# Altium project esp-air-quality-sensor.PrjPcb
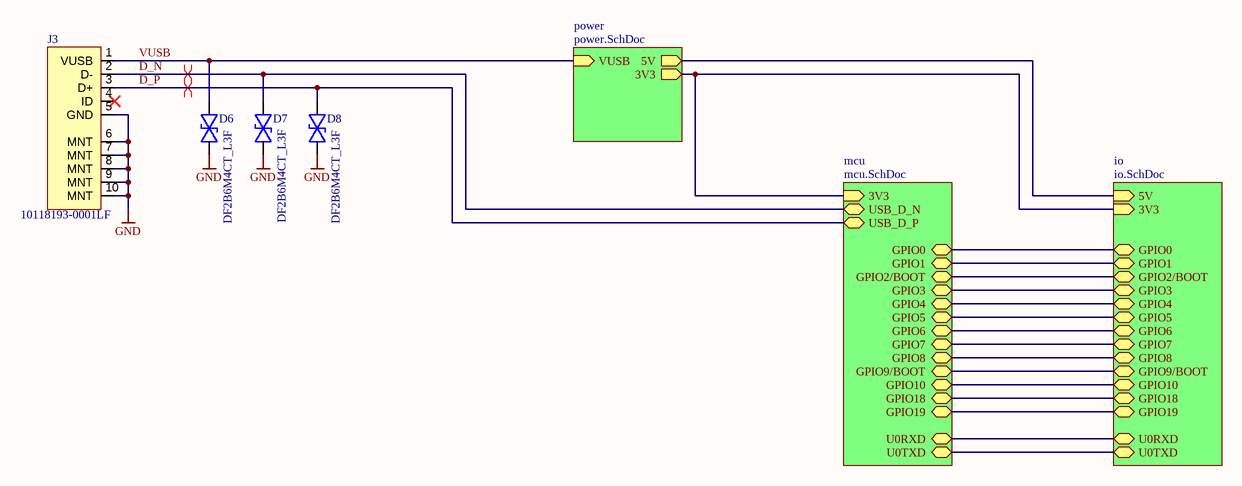
[diagram p0: top.SchDoc]
4 sheets, 65 parts. Net scope: strictly hierarchical (ports join the sheet entries above them; power ports are local).
Board file: board.PcbDoc
Sheets:
  top.SchDoc
    power = power.SchDoc
    mcu = mcu.SchDoc
    io = io.SchDoc

## Sheet top.SchDoc: top schematic
size 420 x 297 mm; Date: 2021-12-08; Author: Joachim Löfwander; Revision: AAA-000; SheetNumber: 1; SheetTotal: 4; Website: github.com/jlofw

### Parts
D6  Manufacturer P/N: DF2B6M4CT_L3F  [D_SOD-882]  (hidden comment: diode_TVS_bi)
D7  Manufacturer P/N: DF2B6M4CT_L3F  [D_SOD-882]  (hidden comment: diode_TVS_bi)
D8  Manufacturer P/N: DF2B6M4CT_L3F  [D_SOD-882]  (hidden comment: diode_TVS_bi)
J3  Manufacturer P/N: 10118193-0001LF  [Amphenol_10118193-0001LF_Micro_USB]  (hidden comment: Amphenol_10118193-0001LF_Micro_USB)

### Sub-sheets
io = io.SchDoc: 5V (in), 3V3 (in), GPIO0 (bidir), GPIO1 (bidir), GPIO3 (bidir), GPIO4 (bidir), GPIO5 (bidir), GPIO6 (bidir), GPIO7 (bidir), GPIO10 (bidir), GPIO18 (bidir), GPIO19 (bidir), GPIO2/BOOT (bidir), GPIO8 (bidir), GPIO9/BOOT (bidir), U0RXD (bidir), U0TXD (bidir)
mcu = mcu.SchDoc: 3V3 (in), USB_D_P (bidir), USB_D_N (bidir), GPIO19 (bidir), GPIO0 (bidir), GPIO4 (bidir), GPIO3 (bidir), GPIO7 (bidir), GPIO18 (bidir), GPIO1 (bidir), GPIO5 (bidir), GPIO6 (bidir), GPIO10 (bidir), GPIO9/BOOT (bidir), GPIO2/BOOT (bidir), GPIO8 (bidir), U0TXD (bidir), U0RXD (bidir)
power = power.SchDoc: VUSB (in), 3V3 (out), 5V (out)

### Nets
GND: D6.2(A) D7.2(A) D8.2(A) J3.5(GND) J3.6(MNT) J3.7(MNT) J3.8(MNT) J3.9(MNT) J3.10(MNT)
3V3: sheet power/3V3, sheet mcu/3V3, sheet io/3V3
5V: sheet power/5V, sheet io/5V
D_N: D7.1(C) J3.2(D-) ; sheet mcu/USB_D_N
D_P: D8.1(C) J3.3(D+) ; sheet mcu/USB_D_P
GPIO0: sheet mcu/GPIO0, sheet io/GPIO0
GPIO1: sheet mcu/GPIO1, sheet io/GPIO1
GPIO2/BOOT: sheet mcu/GPIO2/BOOT, sheet io/GPIO2/BOOT
GPIO3: sheet mcu/GPIO3, sheet io/GPIO3
GPIO4: sheet mcu/GPIO4, sheet io/GPIO4
GPIO5: sheet mcu/GPIO5, sheet io/GPIO5
GPIO6: sheet mcu/GPIO6, sheet io/GPIO6
GPIO7: sheet mcu/GPIO7, sheet io/GPIO7
GPIO8: sheet mcu/GPIO8, sheet io/GPIO8
GPIO9/BOOT: sheet mcu/GPIO9/BOOT, sheet io/GPIO9/BOOT
GPIO10: sheet mcu/GPIO10, sheet io/GPIO10
GPIO18: sheet mcu/GPIO18, sheet io/GPIO18
GPIO19: sheet mcu/GPIO19, sheet io/GPIO19
U0RXD: sheet mcu/U0RXD, sheet io/U0RXD
U0TXD: sheet mcu/U0TXD, sheet io/U0TXD
VUSB: D6.1(C) J3.1(VUSB) ; sheet power/VUSB

Not connected (* = marked no-connect by the designer): J3 4(ID)*

### Layout directives
differential pair: D_N, D_P

### Notes on the sheet
- PROJECT
- TITLE
- FILE NAME
- DATE MODIFIED
- SHEET
- REV
- OF
- AUTHOR
- WEBSITE

### Library data of the parts
D6-D8 = 40005: TVS DIODE 5.5VWM 15VC; Manufacturer: Toshiba; Internal Number: 40005; Package: SOD-882
J3 = 110003: Micro USB B SMD Horisontal; Manufacturer: Amphenol ICC / FCI; Internal Number: 110003

## Sheet power.SchDoc: power
size 420 x 297 mm; Date: 2021-12-08; Author: Joachim Löfwander; Revision: AAA-000; SheetNumber: 2; SheetTotal: 4; Website: github.com/jlofw
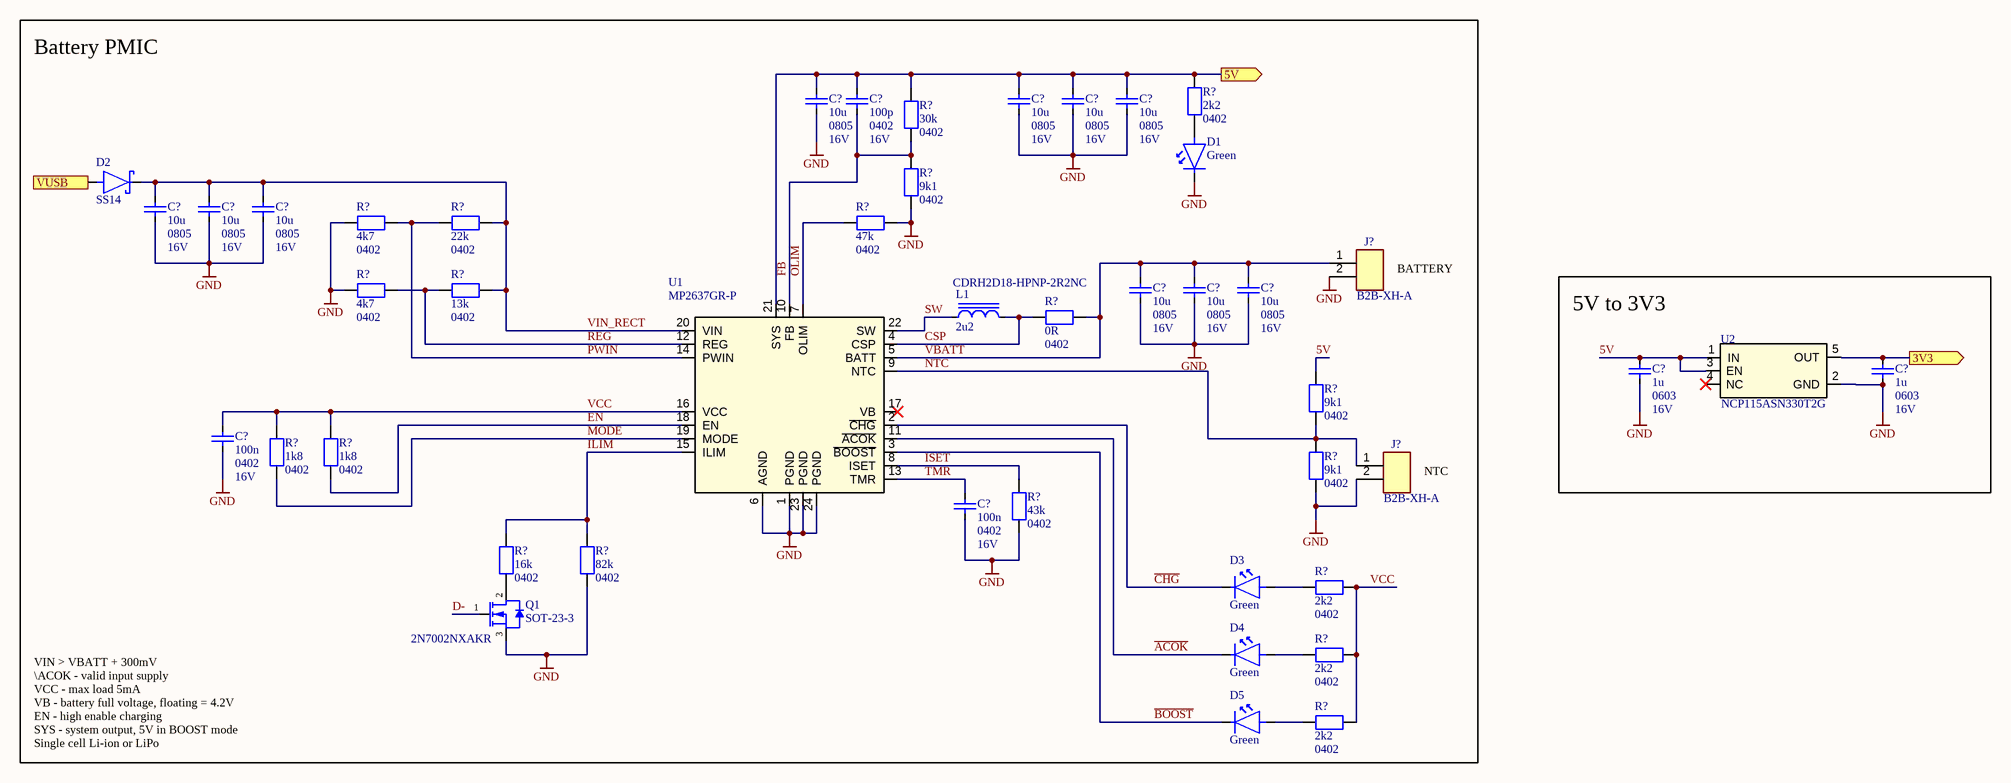
[diagram p1: power.SchDoc]

### Parts
(Parts that share a designator on the sheet are numbered #1, #2 ... from top to bottom, then left to right.)
C?#1  value 10u  Package: 0805  Voltage: 16V  [C_0805_2012Metric_IPCB]  (hidden comment: capacitor_ceramic)
C?#2  value 100p  Package: 0402  Voltage: 16V  [C_0402_1005Metric_IPCB]  (hidden comment: capacitor_ceramic)
C?#3  value 10u  Package: 0805  Voltage: 16V  [C_0805_2012Metric_IPCB]  (hidden comment: capacitor_ceramic)
C?#4  value 10u  Package: 0805  Voltage: 16V  [C_0805_2012Metric_IPCB]  (hidden comment: capacitor_ceramic)
C?#5  value 10u  Package: 0805  Voltage: 16V  [C_0805_2012Metric_IPCB]  (hidden comment: capacitor_ceramic)
C?#6  value 10u  Package: 0805  Voltage: 16V  [C_0805_2012Metric_IPCB]  (hidden comment: capacitor_ceramic)
C?#7  value 10u  Package: 0805  Voltage: 16V  [C_0805_2012Metric_IPCB]  (hidden comment: capacitor_ceramic)
C?#8  value 10u  Package: 0805  Voltage: 16V  [C_0805_2012Metric_IPCB]  (hidden comment: capacitor_ceramic)
C?#9  value 10u  Package: 0805  Voltage: 16V  [C_0805_2012Metric_IPCB]  (hidden comment: capacitor_ceramic)
C?#10  value 10u  Package: 0805  Voltage: 16V  [C_0805_2012Metric_IPCB]  (hidden comment: capacitor_ceramic)
C?#11  value 10u  Package: 0805  Voltage: 16V  [C_0805_2012Metric_IPCB]  (hidden comment: capacitor_ceramic)
C?#12  value 1u  Package: 0603  Voltage: 16V  [C_0603_1608Metric_IPCB]  (hidden comment: capacitor_ceramic)
C?#13  value 1u  Package: 0603  Voltage: 16V  [C_0603_1608Metric_IPCB]  (hidden comment: capacitor_ceramic)
C?#14  value 100n  Package: 0402  Voltage: 16V  [C_0402_1005Metric_IPCB]  (hidden comment: capacitor_ceramic)
C?#15  value 100n  Package: 0402  Voltage: 16V  [C_0402_1005Metric_IPCB]  (hidden comment: capacitor_ceramic)
D1  value Green  [LED_0402]  (hidden comment: diode_LED)
D2  Manufacturer P/N: SS14  [D_SMA_IPCB]  (hidden comment: diode_schottky)
D3  value Green  [LED_0402]  (hidden comment: diode_LED)
D4  value Green  [LED_0402]  (hidden comment: diode_LED)
D5  value Green  [LED_0402]  (hidden comment: diode_LED)
J?#1  Manufacturer P/N: B2B-XH-A  [JST_XH_B2B-XH-A]  (hidden comment: conn_01x02)
J?#2  Manufacturer P/N: B2B-XH-A  [JST_XH_B2B-XH-A]  (hidden comment: conn_01x02)
L1  value 2u2  Manufacturer P/N: CDRH2D18-HPNP-2R2NC  [Sumida_CDRH2D18-HPNP-2R2NC]  (hidden comment: inductor)
Q1  Package: SOT-23-3  Manufacturer P/N: 2N7002NXAKR  [SOT23-3_Standard_IPCB]  (hidden comment: NMOS_GDS)
R?#1  value 2k2  Package: 0402  [R_0402_1005Metric_IPCB]  (hidden comment: resistor)
R?#2  value 30k  Package: 0402  [R_0402_1005Metric_IPCB]  (hidden comment: resistor)
R?#3  value 9k1  Package: 0402  [R_0402_1005Metric_IPCB]  (hidden comment: resistor)
R?#4  value 4k7  Package: 0402  [R_0402_1005Metric_IPCB]  (hidden comment: resistor)
R?#5  value 22k  Package: 0402  [R_0402_1005Metric_IPCB]  (hidden comment: resistor)
R?#6  value 47k  Package: 0402  [R_0402_1005Metric_IPCB]  (hidden comment: resistor)
R?#7  value 4k7  Package: 0402  [R_0402_1005Metric_IPCB]  (hidden comment: resistor)
R?#8  value 13k  Package: 0402  [R_0402_1005Metric_IPCB]  (hidden comment: resistor)
R?#9  value 0R  Package: 0402  [R_0402_1005Metric_IPCB]  (hidden comment: resistor)
R?#10  value 9k1  Package: 0402  [R_0402_1005Metric_IPCB]  (hidden comment: resistor)
R?#11  value 1k8  Package: 0402  [R_0402_1005Metric_IPCB]  (hidden comment: resistor)
R?#12  value 1k8  Package: 0402  [R_0402_1005Metric_IPCB]  (hidden comment: resistor)
R?#13  value 9k1  Package: 0402  [R_0402_1005Metric_IPCB]  (hidden comment: resistor)
R?#14  value 43k  Package: 0402  [R_0402_1005Metric_IPCB]  (hidden comment: resistor)
R?#15  value 16k  Package: 0402  [R_0402_1005Metric_IPCB]  (hidden comment: resistor)
R?#16  value 82k  Package: 0402  [R_0402_1005Metric_IPCB]  (hidden comment: resistor)
R?#17  value 2k2  Package: 0402  [R_0402_1005Metric_IPCB]  (hidden comment: resistor)
R?#18  value 2k2  Package: 0402  [R_0402_1005Metric_IPCB]  (hidden comment: resistor)
R?#19  value 2k2  Package: 0402  [R_0402_1005Metric_IPCB]  (hidden comment: resistor)
U1  Manufacturer P/N: MP2637GR-P  [MP2637GR]  (hidden comment: MP2637GR)
U2  NCP115ASN330T2G  [NCP115ASN330T2G]

### Blocks framed on the sheet
Battery PMIC: C?#1-C?#11 C?#14 C?#15 D1-D5 J?#1 J?#2 L1 Q1 R?#1-R?#19 U1
5V to 3V3: C?#12 C?#13 U2

### Ports
3V3 (out), 5V (out), VUSB (in)

### Nets
GND: C?#1.1 C?#3.1 C?#4.1 C?#5.1 C?#6.1 C?#7.1 C?#8.1 C?#9.1 C?#10.1 C?#11.1 C?#12.1 C?#13.1 C?#14.1 C?#15.1 D1.1(C) J?#1.2 J?#2.2 Q1.3(SOURCE) R?#3.1 R?#4.1 R?#6.2 R?#7.1 R?#13.1 R?#14.1 R?#16.1 U1.1(PGND) U1.6(AGND) U1.23(PGND) U1.24(PGND) U2.2(GND)
3V3: C?#13.2 U2.5(OUT) ; port 3V3
5V: C?#1.2 C?#2.2 C?#3.2 C?#4.2 C?#5.2 R?#1.2 R?#2.2 U1.21(SYS) ; port 5V
5V: C?#12.2 R?#10.2 U2.1(IN) U2.3(EN)  [a separate net that carries the same name]
~{ACOK}: D4.1(C) U1.11(~{ACOK})
~{BOOST}: D5.1(C) U1.3(~{BOOST})
~{CHG}: D3.1(C) U1.2(~{CHG})
CSP: L1.2 R?#9.1 U1.4(CSP)
D-: Q1.1(GATE)
EN: R?#12.1 U1.18(EN)
FB: C?#2.1 R?#2.1 R?#3.2 U1.10(FB)
ILIM: R?#15.2 R?#16.2 U1.15(ILIM)
ISET: R?#14.2 U1.8(ISET)
MODE: R?#11.1 U1.19(MODE)
NTC: J?#2.1 R?#10.1 R?#13.2 U1.9(NTC)
OLIM: R?#6.1 U1.7(OLIM)
PWIN: R?#4.2 R?#5.1 U1.14(PWIN)
REG: R?#7.2 R?#8.1 U1.12(REG)
SW: L1.1 U1.22(SW)
TMR: C?#15.2 U1.13(TMR)
VBATT: C?#9.2 C?#10.2 C?#11.2 J?#1.1 R?#9.2 U1.5(BATT)
VCC: C?#14.2 R?#11.2 R?#12.2 R?#17.2 R?#18.2 R?#19.2 U1.16(VCC)
VIN_RECT: C?#6.2 C?#7.2 C?#8.2 D2.1(C) R?#5.2 R?#8.2 U1.20(VIN)
VUSB: D2.2(A) ; port VUSB
NetD1_2: D1.2(A) R?#1.1
NetD3_2: D3.2(A) R?#17.1
NetD4_2: D4.2(A) R?#18.1
NetD5_2: D5.2(A) R?#19.1
NetQ1_2: Q1.2(DRAIN) R?#15.1

Not connected (* = marked no-connect by the designer): U1 17(VB)*; U2 4(NC)*

### Notes on the sheet
- (near J?#1) BATTERY
- (near J?#2) NTC
- VIN > VBATT + 300mV
  \ACOK - valid input supply
  VCC - max load 5mA
  VB - battery full voltage, floating = 4.2V
  EN - high enable charging
  SYS - system output, 5V in BOOST mode
  Single cell Li-ion or LiPo
- PROJECT
- TITLE
- FILE NAME
- DATE MODIFIED
- SHEET
- REV
- OF
- AUTHOR
- WEBSITE

### Library data of the parts
C?#1 C?#3-C?#11 = 20174: 16V 0805; Internal Number: 20174
C?#2 = 20007: 16V 0402; Internal Number: 20007
C?#12 C?#13 = 20100: 16V 0603; Internal Number: 20100
C?#14 C?#15 = 20025: 16V 0402; Internal Number: 20025
D1 D3-D5 = 40002: LED 0402 Green; Internal Number: 40002; Package: 0402
D2 = 40006: Schottky 40 V 1A SMA; Manufacturer: onsemi; Internal Number: 40006; Package: SMA
J?#1 J?#2 = 110010: JST XH Vertical TH 2p; Internal Number: 110010; Manufacturer: JST
L1 = 190001: Inductor 2.2uH 1.6A 60mOhm; Manufacturer: Sumida; Internal Number: 190001
Q1 = 60001: 60V 300mA NMOS SOT-23-3; Manufacturer: Nexperia; Internal Number: 60001
R?#1 R?#17-R?#19 = 10082: 0402 1%; Internal Number: 10082
R?#2 = 10109: 0402 1%; Internal Number: 10109
R?#3 R?#10 R?#13 = 10097: 0402 1%; Internal Number: 10097
R?#4 R?#7 = 10090: 0402 1%; Internal Number: 10090
R?#5 = 10106: 0402 1%; Internal Number: 10106
R?#6 = 10114: 0402 1%; Internal Number: 10114
R?#8 = 10101: 0402 1%; Internal Number: 10101
R?#9 = 10001: 0402 1%; Internal Number: 10001
R?#11 R?#12 = 10080: 0402 1%; Internal Number: 10080
R?#14 = 10113: 0402 1%; Internal Number: 10113
R?#15 = 10103: 0402 1%; Internal Number: 10103
R?#16 = 10120: 0402 1%; Internal Number: 10120
U1 = 180003: MP2637GR Li-ion charger; Manufacturer: Monolithic Power Systems; Internal Number: 180003; Package: QFN
U2 = 80001: 3V3 LDO 300mA; Manufacturer: onsemi; Internal Number: 80001; Manufacturer P/N: NCP115ASN330T2G; Package: TSOP5

## Sheet mcu.SchDoc: mcu
size 420 x 297 mm; Date: 2021-12-08; Author: Joachim Löfwander; Revision: AAA-000; SheetNumber: 3; SheetTotal: 4; Website: github.com/jlofw
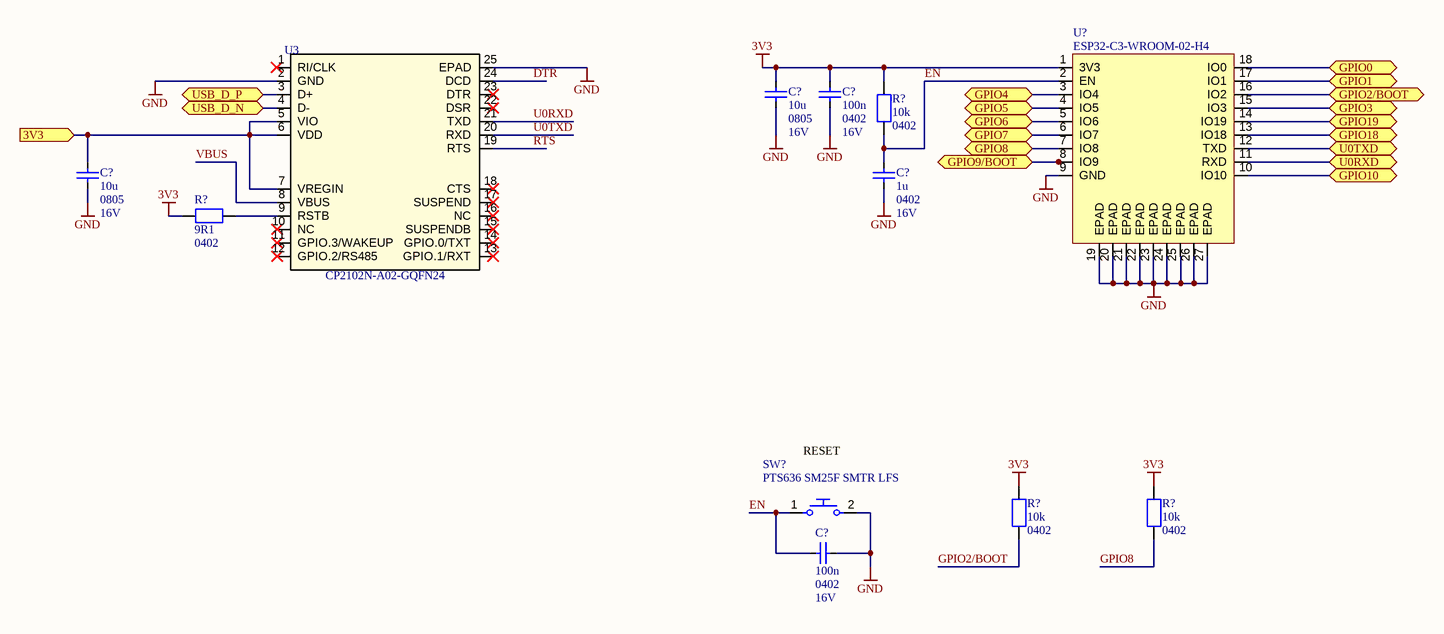
[diagram p2: mcu.SchDoc]

### Parts
(Parts that share a designator on the sheet are numbered #1, #2 ... from top to bottom, then left to right.)
C?#16  value 10u  Package: 0805  Voltage: 16V  [C_0805_2012Metric_IPCB]  (hidden comment: capacitor_ceramic)
C?#17  value 100n  Package: 0402  Voltage: 16V  [C_0402_1005Metric_IPCB]  (hidden comment: capacitor_ceramic)
C?#18  value 10u  Package: 0805  Voltage: 16V  [C_0805_2012Metric_IPCB]  (hidden comment: capacitor_ceramic)
C?#19  value 1u  Package: 0402  Voltage: 16V  [C_0402_1005Metric_IPCB]  (hidden comment: capacitor_ceramic)
C?#20  value 100n  Package: 0402  Voltage: 16V  [C_0402_1005Metric_IPCB]  (hidden comment: capacitor_ceramic)
R?#20  value 10k  Package: 0402  [R_0402_1005Metric_IPCB]  (hidden comment: resistor)
R?#21  value 9R1  Package: 0402  [R_0402_1005Metric_IPCB]  (hidden comment: resistor)
R?#22  value 10k  Package: 0402  [R_0402_1005Metric_IPCB]  (hidden comment: resistor)
R?#23  value 10k  Package: 0402  [R_0402_1005Metric_IPCB]  (hidden comment: resistor)
SW?  Manufacturer P/N: PTS636 SM25F SMTR LFS  [Pushbutton_PTS636_SM25F_SMTR_LFS]  (hidden comment: SW_single_no_bridging_pads)
U3  Manufacturer P/N: CP2102N-A02-GQFN24  [CP2102N_QFN24]  (hidden comment: CP2102N_QFN24)
U?  ESP32-C3-WROOM-02-H4  [ESP32-C3-WROOM-02-H4]

### Ports
3V3 (in), GPIO0 (bidir), GPIO1 (bidir), GPIO2/BOOT (bidir), GPIO3 (bidir), GPIO4 (bidir), GPIO5 (bidir), GPIO6 (bidir), GPIO7 (bidir), GPIO8 (bidir), GPIO9/BOOT (bidir), GPIO10 (bidir), GPIO18 (bidir), GPIO19 (bidir), U0RXD (bidir), U0TXD (bidir), USB_D_N (bidir), USB_D_P (bidir)

### Nets
3V3: C?#16.2 C?#17.2 R?#20.2 R?#21.1 R?#22.2 R?#23.2 U?.1(3V3)
GND: C?#16.1 C?#17.1 C?#18.1 C?#19.1 C?#20.2 SW?.2 U3.2(GND) U3.25(EPAD) U?.9(GND) U?.19(EPAD) U?.20(EPAD) U?.21(EPAD) U?.22(EPAD) U?.23(EPAD) U?.24(EPAD) U?.25(EPAD) U?.26(EPAD) U?.27(EPAD)
3V3: C?#18.2 U3.5(VIO) U3.6(VDD) U3.7(VREGIN) ; port 3V3  [a separate net that carries the same name]
D_N: U3.4(D-) ; port USB_D_N
D_P: U3.3(D+) ; port USB_D_P
DTR: U3.24(DCD)
EN: C?#19.2 C?#20.1 R?#20.1 SW?.1 U?.2(EN)
GPIO0: U?.18(IO0) ; port GPIO0
GPIO1: U?.17(IO1) ; port GPIO1
GPIO2/BOOT: U?.16(IO2) ; port GPIO2/BOOT
GPIO2/BOOT: R?#22.1  [a separate net that carries the same name]
GPIO3: U?.15(IO3) ; port GPIO3
GPIO4: U?.3(IO4) ; port GPIO4
GPIO5: U?.4(IO5) ; port GPIO5
GPIO6: U?.5(IO6) ; port GPIO6
GPIO7: U?.6(IO7) ; port GPIO7
GPIO8: U?.7(IO8) ; port GPIO8
GPIO8: R?#23.1  [a separate net that carries the same name]
GPIO9/BOOT: U?.8(IO9) ; port GPIO9/BOOT
GPIO10: U?.10(IO10) ; port GPIO10
GPIO18: U?.13(IO18) ; port GPIO18
GPIO19: U?.14(IO19) ; port GPIO19
RTS: U3.19(RTS)
U0RXD: U3.21(TXD)
U0RXD: U?.11(RXD) ; port U0RXD  [a separate net that carries the same name]
U0TXD: U3.20(RXD)
U0TXD: U?.12(TXD) ; port U0TXD  [a separate net that carries the same name]
VBUS: U3.8(VBUS)
NetR?#21_2: R?#21.2 U3.9(RSTB)

Not connected (* = marked no-connect by the designer): U3 1(RI/CLK)* 10(NC)* 11(GPIO.3/WAKEUP)* 12(GPIO.2/RS485)* 13(GPIO.1/RXT)* 14(GPIO.0/TXT)* 15(SUSPENDB)* 16(NC)* 17(SUSPEND)* 18(CTS)* 22(DSR)* 23(DTR)*

### Notes on the sheet
- RESET
- PROJECT
- TITLE
- FILE NAME
- DATE MODIFIED
- SHEET
- REV
- OF
- AUTHOR
- WEBSITE

### Library data of the parts
C?#16 C?#18 = 20170: 16V 0805; Internal Number: 20170
C?#17 C?#20 = 20025: 16V 0402; Internal Number: 20025
C?#19 = 20031: 16V 0402; Internal Number: 20031
R?#20 R?#22 R?#23 = 10098: 0402 1%; Internal Number: 10098
R?#21 = 10025: 0402 1%; Internal Number: 10025
SW? = 100001: Manufacturer: C&K; Internal Number: 100001
U3 = 90002: USB to UART; Manufacturer: Silicon Labs; Internal Number: 90002; Package: QFN24
U? = 130001: ESP32 C3 SoC; Manufacturer: Espressif Systems; Internal Number: 130001; Manufacturer P/N: ESP32-C3-WROOM-02-H4; Package: SoC

## Sheet io.SchDoc: sensor
size 420 x 297 mm; Date: 2021-12-08; Author: Joachim Löfwander; Revision: AAA-000; SheetNumber: 4; SheetTotal: 4; Website: github.com/jlofw
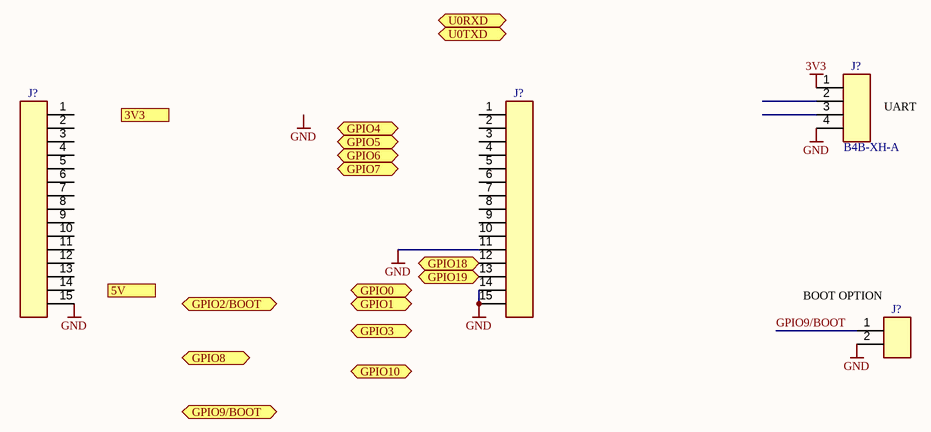
[diagram p3: io.SchDoc]

### Parts
(Parts that share a designator on the sheet are numbered #1, #2 ... from top to bottom, then left to right.)
J?#3  Manufacturer P/N: B4B-XH-A  [JST_XH_B4B-XH-A]  (hidden comment: conn_01x04)
J?#4  conn_01x15  [PinHeader_1x015_P2.54mm_Vertical]  (value not drawn)
J?#5  conn_01x15  [PinHeader_1x015_P2.54mm_Vertical]  (value not drawn)
J?#6  conn_01x02  [PinHeader_1x02_P2.54mm_Vertical]  (value not drawn)

### Ports
3V3 (in), 5V (in), GPIO0 (bidir), GPIO1 (bidir), GPIO2/BOOT (bidir), GPIO3 (bidir), GPIO4 (bidir), GPIO5 (bidir), GPIO6 (bidir), GPIO7 (bidir), GPIO8 (bidir), GPIO9/BOOT (bidir), GPIO10 (bidir), GPIO18 (bidir), GPIO19 (bidir), U0RXD (bidir), U0TXD (bidir)

### Nets
3V3: J?#3.1
GND: J?#3.4 J?#4.15 J?#5.11 J?#5.14 J?#5.15 J?#6.2
GPIO9/BOOT: J?#6.1
GPIO18: J?#5.12 ; port GPIO18
GPIO19: J?#5.13 ; port GPIO19

Not connected (* = marked no-connect by the designer): J?#3 2 3; J?#4 1 2 3 4 5 6 7 8 9 10 11 12 13 14; J?#5 1 2 3 4 5 6 7 8 9 10

### Notes on the sheet
- (near J?#3) UART
- (near J?#6) BOOT OPTION
- Labels drawn without touching a wire or pin: GND
- PROJECT
- TITLE
- FILE NAME
- DATE MODIFIED
- SHEET
- REV
- OF
- AUTHOR
- WEBSITE

### Library data of the parts
J?#3 = 110022: JST XH Vertical TH 4p; Internal Number: 110022; Manufacturer: JST
J?#4 J?#5 = 110014: 01x15 P2.54 Pin Header Vertical; Internal Number: 110014
J?#6 = 110001: 01x02 P2.54 Pin Header Vertical; Internal Number: 110001

## Nets that join several sheets
3V3: power (C?#13.2 U2.5), mcu (C?#18.2 U3.5 U3.6 U3.7)
D_N: top (D7.1 J3.2), mcu (U3.4)
D_P: top (D8.1 J3.3), mcu (U3.3)
GPIO18: mcu (U?.13), io (J?#5.12)
GPIO19: mcu (U?.14), io (J?#5.13)
VUSB: top (D6.1 J3.1), power (D2.2)